# Altium project MK_175.PrjPcb
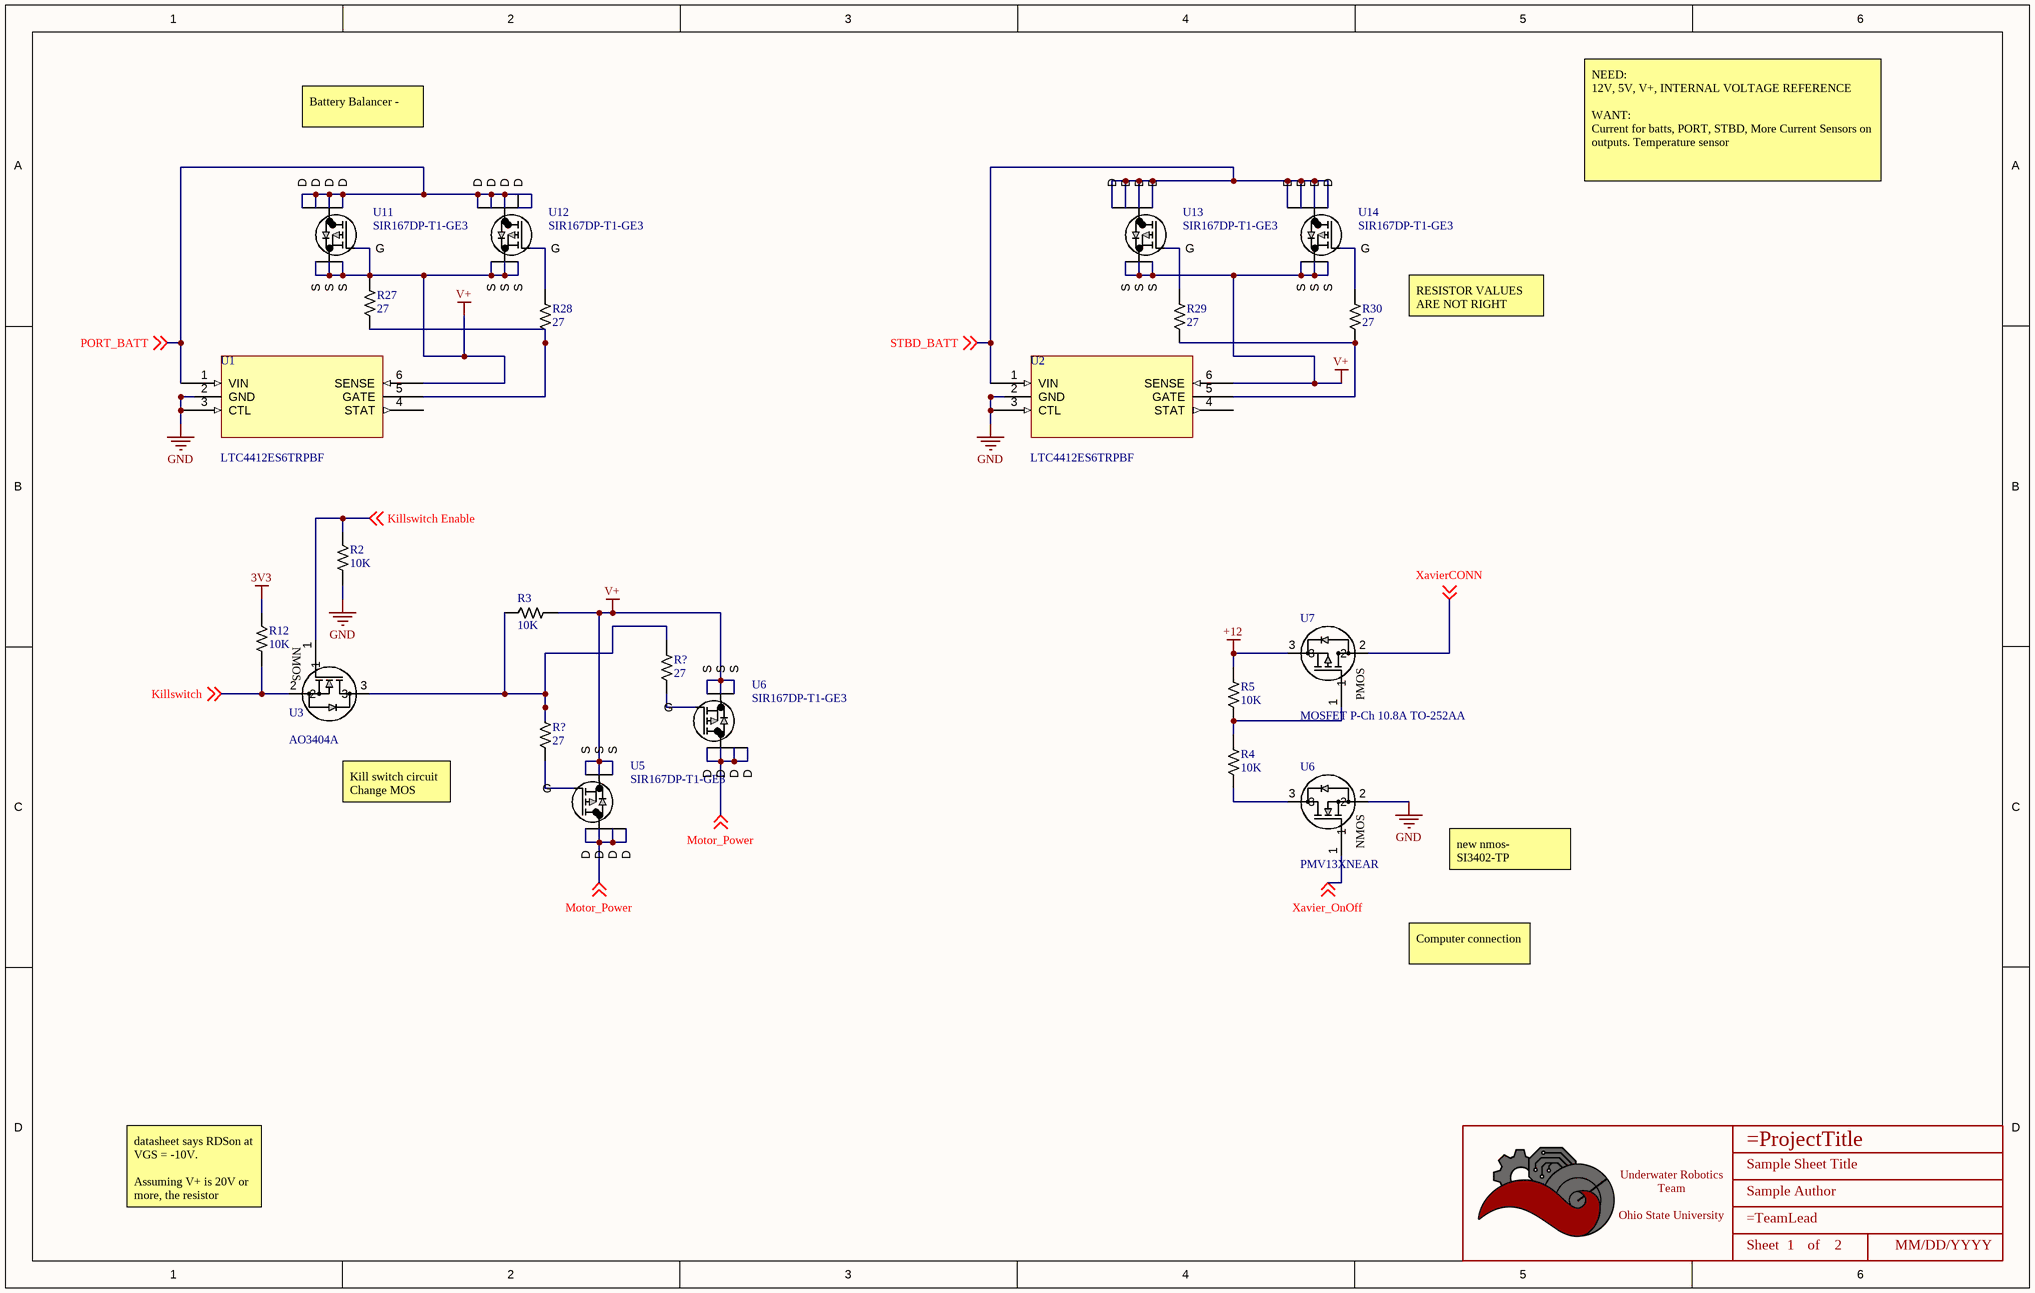
[diagram p0: M1_75S.SchDoc]
2 sheets, 44 parts. Net scope: flat (ports and power ports of the same name join across sheets).
Board file: PD1_75.PcbDoc
Sheets:
  M1_75S.SchDoc
  M1_75S2.SchDoc

## Sheet M1_75S.SchDoc: Sample Sheet Title
size B; Date: MM/DD/YYYY; Author: Sample Author; Organization: ORGANIZATION; Address1: ADDRESS 1; Address2: ADDRESS 2; Address3: ADDRESS 3; Address4: ADDRESS 4; Revision: -; SheetNumber: 1; SheetTotal: 2; ENG_APP_DATE: --/--/--; DSN_APP_DATE: --/--/--; CHK_APP_DATE: --/--/--

### Parts
(Parts that share a designator on the sheet are numbered #1, #2 ... from top to bottom, then left to right.)
*#1  Title_Block  [LOGO]  (value not drawn)  (graphical)
R2  Value  (Ohms): 10K  [RESISTOR_0603]  (hidden comment: 10k Ohm 5% 1/10W)
R3  Value  (Ohms): 10K  [RESISTOR_0603]  (hidden comment: 10k Ohm 5% 1/10W)
R4  Value  (Ohms): 10K  [RESISTOR_0603]  (hidden comment: 10k Ohm 5% 1/10W)
R5  Value  (Ohms): 10K  [RESISTOR_0603]  (hidden comment: 10k Ohm 5% 1/10W)
R12  Value  (Ohms): 10K  [RESISTOR_0603]  (hidden comment: 10k Ohm 5% 1/10W)
R27  Value  (Ohms): 27  [RESISTOR_0603]  (hidden comment: 27 Ohm 5% 1/8W)
R28  Value  (Ohms): 27  [RESISTOR_0603]  (hidden comment: 27 Ohm 5% 1/8W)
R29  Value  (Ohms): 27  [RESISTOR_0603]  (hidden comment: 27 Ohm 5% 1/8W)
R30  Value  (Ohms): 27  [RESISTOR_0603]  (hidden comment: 27 Ohm 5% 1/8W)
R?#1  Value  (Ohms): 27  [RESISTOR_0603]  (hidden comment: 27 Ohm 5% 1/8W)
R?#2  Value  (Ohms): 27  [RESISTOR_0603]  (hidden comment: 27 Ohm 5% 1/8W)
U1  LTC4412ES6TRPBF  [TSOT-23_S6]
U2  LTC4412ES6TRPBF  [TSOT-23_S6]
U3  AO3404A  [SOT-23-3]
U5  SIR167DP-T1-GE3  [MOSFET_7DP-T1-GE3_VIS]
U6#1  SIR167DP-T1-GE3  [MOSFET_7DP-T1-GE3_VIS]
U6#2  PMV13XNEAR  [SOT-23-3]
U7  MOSFET P-Ch 10.8A TO-252AA  [DPAK_ONS]
U11  SIR167DP-T1-GE3  [MOSFET_7DP-T1-GE3_VIS]
U12  SIR167DP-T1-GE3  [MOSFET_7DP-T1-GE3_VIS]
U13  SIR167DP-T1-GE3  [MOSFET_7DP-T1-GE3_VIS]
U14  SIR167DP-T1-GE3  [MOSFET_7DP-T1-GE3_VIS]

### Nets
3V3: R12.2
+12: R5.1 U7.3
GND: R2.1 U1.2(GND) U1.3(CTL) U2.2(GND) U2.3(CTL) U6#2.2
V+: R3.1 R27.1 U1.6(SENSE) U2.6(SENSE) U5.1(S) U5.2(S) U5.3(S) U6#1.1(S) U6#1.2(S) U6#1.3(S) U11.1(S) U11.2(S) U11.3(S) U11.4(G) U12.1(S) U12.2(S) U12.3(S) U13.1(S) U13.2(S) U13.3(S) U14.1(S) U14.2(S) U14.3(S)
Killswitch: R12.1 U3.2 ; off-sheet Killswitch
Killswitch Enable: R2.2 U3.1 ; off-sheet Killswitch Enable
Motor_Power: U5.5(D) U5.6(D) U5.7(D) U5.8(D) U6#1.5(D) U6#1.6(D) U6#1.7(D) U6#1.8(D) ; off-sheet Motor_Power
PORT_BATT: U1.1(VIN) U11.5(D) U11.6(D) U11.7(D) U11.8(D) U12.5(D) U12.6(D) U12.7(D) U12.8(D) ; off-sheet PORT_BATT
STBD_BATT: U2.1(VIN) U13.5(D) U13.6(D) U13.7(D) U13.8(D) U14.5(D) U14.6(D) U14.7(D) U14.8(D) ; off-sheet STBD_BATT
Xavier_OnOff: U6#2.1 ; off-sheet Xavier_OnOff
XavierCONN: U7.2 ; off-sheet XavierCONN
NetR3_2: R3.2 R?#1.1 R?#2.1 U3.3
NetR4_1: R4.1 R5.2 U7.1
NetR4_2: R4.2 U6#2.3
NetR27_2: R27.2 R28.2 U1.5(GATE)
NetR28_1: R28.1 U12.4(G)
NetR29_1: R29.1 U13.4(G)
NetR29_2: R29.2 R30.2 U2.5(GATE)
NetR30_1: R30.1 U14.4(G)
NetR?#1_2: R?#1.2 U6#1.4(G)
NetR?#2_2: R?#2.2 U5.4(G)

Not connected (* = marked no-connect by the designer): U1 4(STAT); U2 4(STAT)

### Notes on the sheet
- Battery Balancer -
- NEED:
  12V, 5V, V+, INTERNAL VOLTAGE REFERENCE
  WANT:
  Current for batts, PORT, STBD, More Current Sensors on outputs. Temperature sensor
- RESISTOR VALUES ARE NOT RIGHT (R27-R30)
- Kill switch circuit Change MOS
- new nmos- SI3402-TP https://www.digikey.com/en/products/detail/micro-commercial-co/SI3402-TP/7681854
- Computer connection
- datasheet says RDSon at VGS = -10V.
  Assuming V+ is 20V or more, the resistor divider will make Vg 10 V which would mean VGS is -10V
- DWG. NO.
- REV.
- SHT.
- THIS DOCUMENT AND THE DATA DISCLOSED HEREIN OR HEREWITH IS THE PROPERTY OF ALTIUM LIMITED AND MAY BE FREELY DISTRIBUTED IN WHOLE. NO RIGHTS ARE RESERVED OR EXPRESS OR IMPLIED WARANTEE GIVEN.
- REVISION
- DESCRIPTION
- DATE
- APPROVED
- ENG:
- APPROVALS
- PROJECT
- DSN:
- CHK:
- REFERENCE DOCUMENTS
- PROJECT REVISION:
- TITLE
- DOCUMENT REVISION:
- DESIGN ITEM:
- BOM:
- FAB DWG:
- PCB DWG:
- ASSY DWG:
- SCALE:
- SIZE
- B
- CAGE CODE
- FILE NAME
- DWG NO.
- SHEET
- OF
- REV
- (in symbol AO3404A) NMOS
- (in symbol FDD4141) PMOS
- (in symbol PMV13XNEAR) NMOS
- (in symbol Title_Block) Underwater Robotics Team / Ohio State University; Sheet; of

### Library data of the parts
*#1 = Title_Block: UWRT Schematic Title Block Template / Created June 2021, Dylan Trainor
R2-R5 R12 = RESISTOR_10K_0603: RES 10k OHM 5% 1/10W 0603; Tolerance: +/- 5%; Wattage: 1/8W; Made By: Robert Pafford; ComponentLink1Description: Datasheet; ComponentLink1URL: https://www.bourns.com/docs/product-datasheets/CRxxxxx.pdf; Supplier: Digikey; Digikey Part Numer: CR0603-JW-104ELFTR-ND; Supplier 1: Digi-Key; Supplier Part Number 1: 2019-RK73B1JTTD103JCT-ND
R27-R30 R?#1 R?#2 = RESISTOR_27_0603: RES 27 OHM 5% 1/8W 0603; Tolerance: +/- 5%; Made By: Robert Pafford; ComponentLink1Description: Datasheet; ComponentLink1URL: https://www.bourns.com/docs/product-datasheets/CRxxxxx.pdf; Wattage: 1/8W; Supplier: Digikey; Digikey Part Numer: CR0603-JW-104ELFTR-ND; Supplier 1: Digi-Key; Supplier Part Number 1: 2019-RK73B1JTTD270JCT-ND
U1 U2 = LTC4412ES6TRPBF: OR Controller Source Selector Switch P-Channel 2:1 TSOT-23-6; MP: LTC4412ES6#TRPBF; MF: Analog Devices; Price: None; Availability: Good; Mouser-Purchase-URL: https://snapeda.com/shop?store=Mouser&id=4343773; Arrow_Europe-Purchase-URL: https://snapeda.com/shop?store=Arrow+Europe&id=4343773; DigiKey-Purchase-URL: https://snapeda.com/shop?store=DigiKey&id=4343773; Package: SOT-23-6 Analog Devices; SnapEDA_Link: https://www.snapeda.com/parts/LTC4412ES6%23TRPBF/Analog%20Devices/view-part/4343773/?ref=snap; Value: *; Check_prices: https://www.snapeda.com/parts/LTC4412ES6%23TRPBF/Analog%20Devices/view-part/4343773/?ref=eda
U3 = AO3404A: N-Channel 30 V 5.8A (Ta) 1.4W (Ta) Surface Mount SOT-23-3; Vendor: Alpha & Omega Semiconductor Inc.; SourceLibrary: ON_Semiconductor_2020-01-13; Vgs (Max): 3V @ 5.8A, 10V; Vgs (th): 3V @ 250µA; Vdss: 30V; Rds (on): 28mOhm @ 5.8A, 10V; Amp Rating: 5.8 A; FET Type: N-Channel; Package: SOT23-3L; Manufacturer _Part_Number: AO3404A; Power Dissipation: 1.4W (Ta); Supplier 1: Digi-Key; Supplier Part Number 1: 785-1004-1-ND; Created By: Dylan T
U5 U6#1 U11-U14 = SIR167DP-T1-GE3: P-Channel 30 V 60A (Tc) 65.8W (Tc) Surface Mount PowerPAK® SO-8; Mfr_Name: Vishay; Copyright: Copyright (C) 2022 Ultra Librarian. All rights reserved.; Manufacturer_Part_Number: SIR167DP-T1-GE3; RefDes: RefDes; Type: DEV
U6#2 = PMV13XNEAR: N-Channel 20 V 7.3A (Ta) 610mW (Ta), 8.3W (Tc) Surface Mount TO-236AB; Vendor: Nexperia USA Inc.; SourceLibrary: ON_Semiconductor_2020-01-13; Vgs (Max): +/- 12 V; Vgs (th): 1.3V @ 250uA; Vdss: 20 V; Rds (on): 15mOhm @ 7.3A, 8V; Amp Rating: 7.3 A; FET Type: N-Channel; Package: SOT23-3L; Manufacturer _Part_Number: PMV13XNEAR; Power Dissipation: 610mW (Ta), 8.3W (Tc); Created By: Dylan T; Supplier 1: Mouser; Supplier Part Number 1: 771-PMV13XNEAR
U7 = FDD4141: P-Channel 10.8A (Ta), 50A (Tc) 2.4W (Ta), 69W (Tc) Surface Mount D-PAK (TO-252AA); FET Type: P-Channel, Power; Vendor: ON Semiconductor; SourceLibrary: ON_Semiconductor_2020-01-13; Vgs (Max): ±20V; Vgs (th): 3V @ 250µA; Vdss: 40 V; Rds (on): 12.3mOhm @ 12.7A, 10V; Amp Rating: 10.8 A; Package: D-PAK (TO-252AA); Manufacturer_Part_Number: FDD4141; Power Dissipation: 2.4W (Ta), 69W (Tc); Supplier 1: Digi-Key; Supplier Part Number 1: FDD4141CT-ND; Created By: Dylan T

## Sheet M1_75S2.SchDoc: Sample Sheet Title
size B; Date: MM/DD/YYYY; Author: Sample Author; Organization: ORGANIZATION; Address1: ADDRESS 1; Address2: ADDRESS 2; Address3: ADDRESS 3; Address4: ADDRESS 4; Revision: -; SheetNumber: 2; SheetTotal: 2; ENG_APP_DATE: --/--/--; DSN_APP_DATE: --/--/--; CHK_APP_DATE: --/--/--
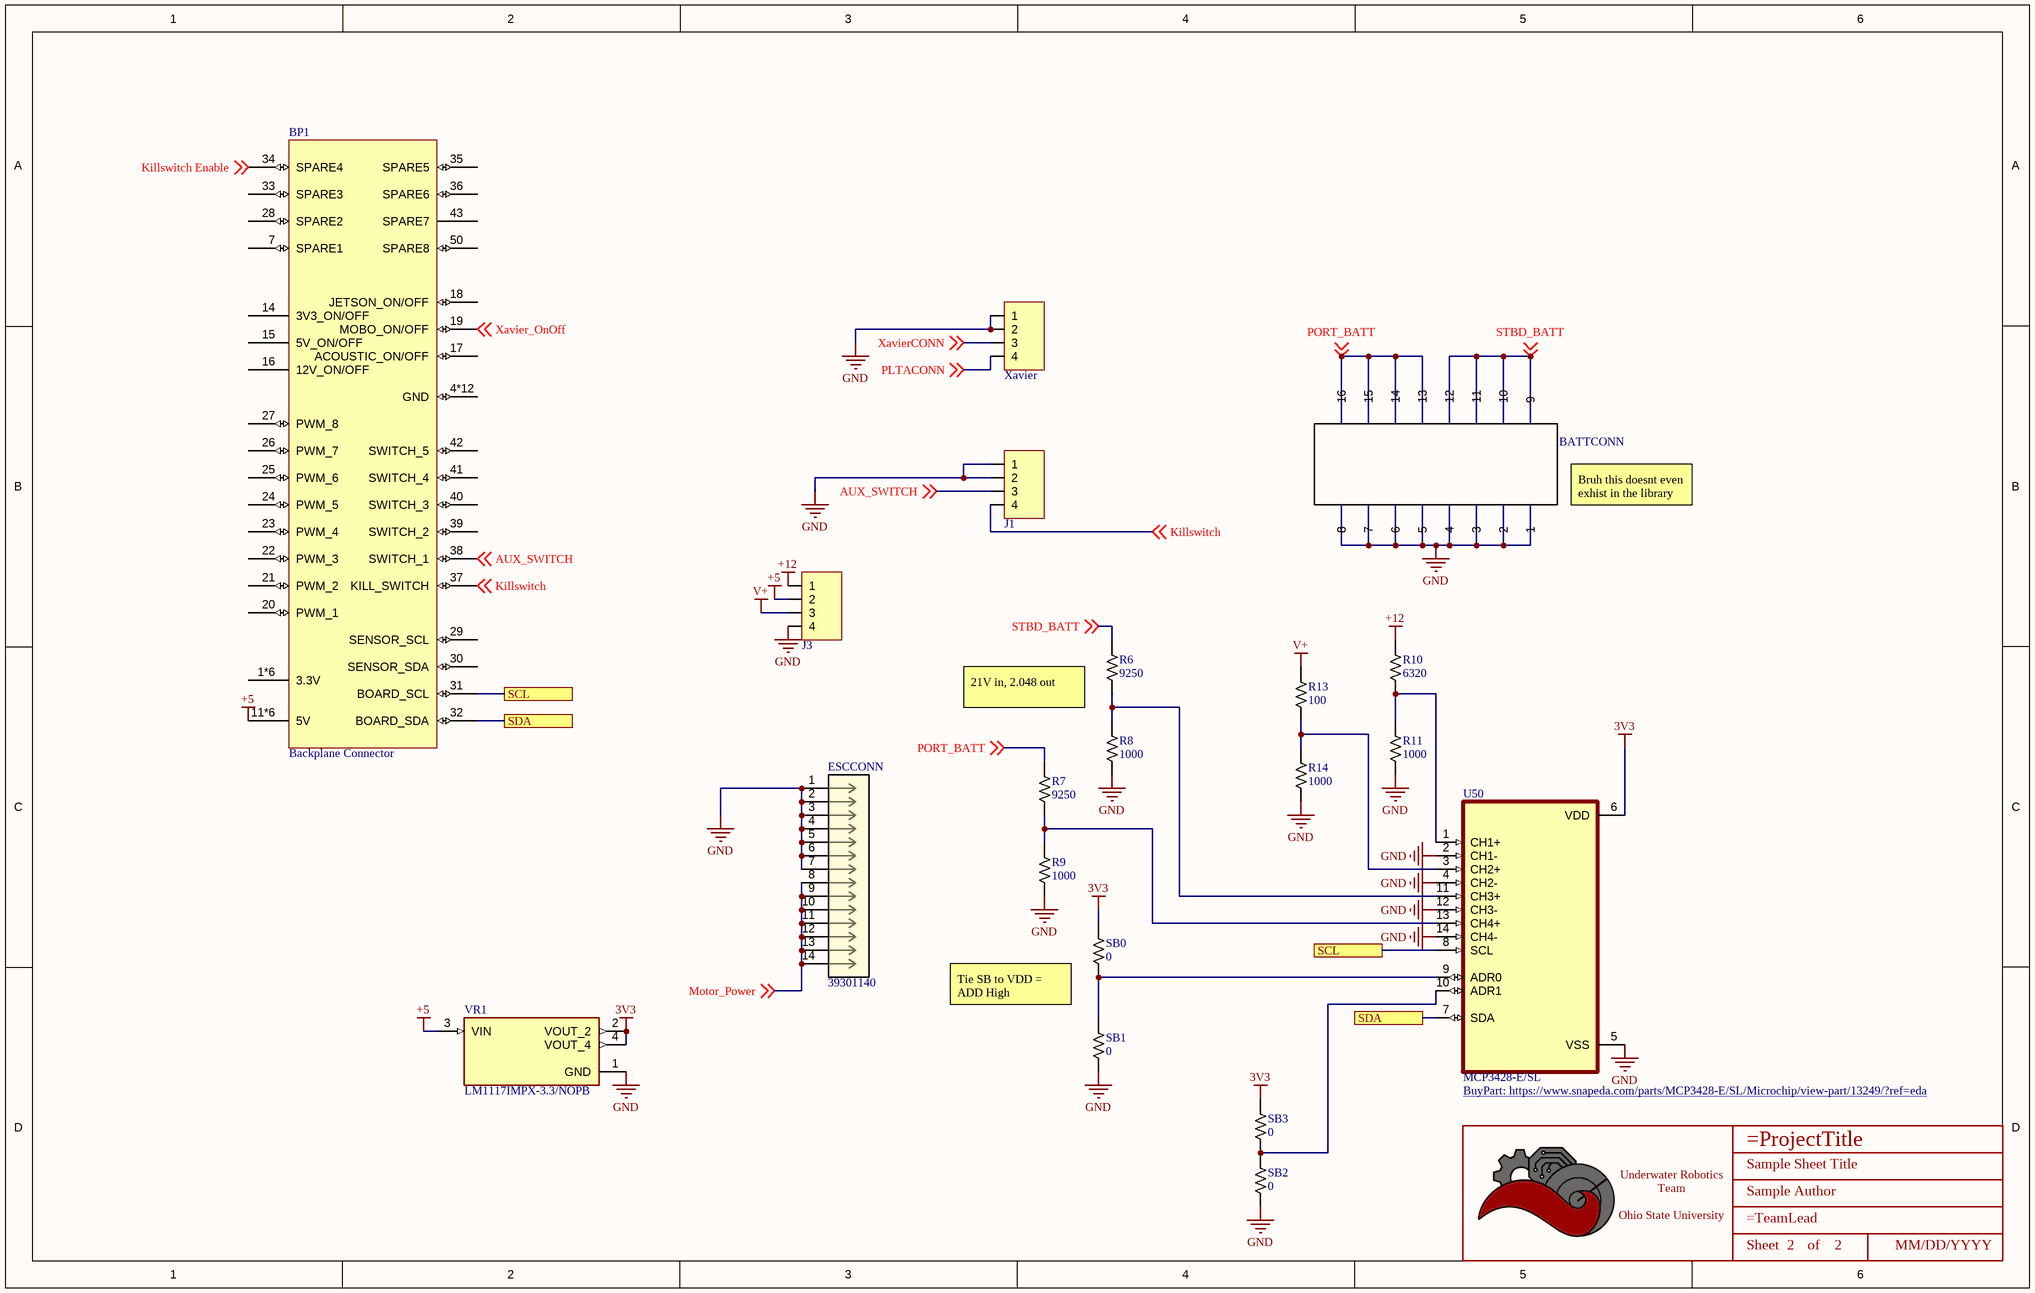
[diagram p1: M1_75S2.SchDoc]

### Parts
(Parts that share a designator on the sheet are numbered #1, #2 ... from top to bottom, then left to right.)
*#2  Title_Block  [LOGO]  (value not drawn)  (graphical)
BATTCONN  BatteryConnector  [CONN_MOLEX_MINIFIT JR_16 POS_R/A - duplicate]  (value not drawn)
BP1  Backplane Connector  [BACKPLANE_EDGE_CONN]
ESCCONN  39301140  [CON_39301140]
J1  4 POS R/A  [CONN_MOLEX_MINIFIT JR_4 POS_R/A]  (value not drawn)
J3  4 POS R/A  [CONN_MOLEX_MINIFIT JR_4 POS_R/A]  (value not drawn)
R6  Value  (Ohms): 9250  [RESISTOR_0603]  (hidden comment: 100 Ohm 5% 1/8W)
R7  Value  (Ohms): 9250  [RESISTOR_0603]  (hidden comment: 100 Ohm 5% 1/8W)
R8  Value  (Ohms): 1000  [RESISTOR_0603]  (hidden comment: 100 Ohm 5% 1/8W)
R9  Value  (Ohms): 1000  [RESISTOR_0603]  (hidden comment: 100 Ohm 5% 1/8W)
R10  Value  (Ohms): 6320  [RESISTOR_0603]  (hidden comment: 100 Ohm 5% 1/8W)
R11  Value  (Ohms): 1000  [RESISTOR_0603]  (hidden comment: 100 Ohm 5% 1/8W)
R13  Value  (Ohms): 100  [RESISTOR_0603]  (hidden comment: 100 Ohm 5% 1/8W)
R14  Value  (Ohms): 1000  [RESISTOR_0603]  (hidden comment: 100 Ohm 5% 1/8W)
SB0  Value  (Ohms): 0  [RESISTOR_0603]  (hidden comment: 0 Ohm Jumper No Fit)
SB1  Value  (Ohms): 0  [RESISTOR_0603]  (hidden comment: 0 Ohm Jumper No Fit)
SB2  Value  (Ohms): 0  [RESISTOR_0603]  (hidden comment: 0 Ohm Jumper No Fit)
SB3  Value  (Ohms): 0  [RESISTOR_0603]  (hidden comment: 0 Ohm Jumper No Fit)
U50  MCP3428-E/SL  [SOIC127P600X175-14N]
VR1  LM1117IMPX-3.3/NOPB  [SOT-223-4]
Xavier  4 POS R/A  [CONN_MOLEX_MINIFIT JR_4 POS_R/A]  (value not drawn)

### Ports
SCL, SDA

### Nets
3V3: SB0.1 SB3.1 U50.6(VDD) VR1.2(VOUT_2) VR1.4(VOUT_4)
+5: BP1.11*6(5V) J3.2 VR1.3(VIN)
+12: J3.1 R10.1
GND: BATTCONN.1 BATTCONN.2 BATTCONN.3 BATTCONN.4 BATTCONN.5 BATTCONN.6 BATTCONN.7 BATTCONN.8 ESCCONN.1 ESCCONN.2 ESCCONN.3 ESCCONN.4 ESCCONN.5 ESCCONN.6 ESCCONN.7 J1.1 J1.2 J3.4 R8.2 R9.2 R11.2 R14.2 SB1.2 SB2.2 U50.2(CH1-) U50.4(CH2-) U50.5(VSS) U50.12(CH3-) U50.14(CH4-) VR1.1(GND) Xavier.1 Xavier.2
V+: J3.3 R13.1
AUX_SWITCH: BP1.38(SWITCH_1) J1.3 ; off-sheet AUX_SWITCH
Killswitch: BP1.37(KILL_SWITCH) J1.4 ; off-sheet Killswitch
Killswitch Enable: BP1.34(SPARE4) ; off-sheet Killswitch Enable
Motor_Power: ESCCONN.8 ESCCONN.9 ESCCONN.10 ESCCONN.11 ESCCONN.12 ESCCONN.13 ESCCONN.14 ; off-sheet Motor_Power
PLTACONN: Xavier.4 ; off-sheet PLTACONN
PORT_BATT: BATTCONN.13 BATTCONN.14 BATTCONN.15 BATTCONN.16 R7.1 ; off-sheet PORT_BATT
STBD_BATT: BATTCONN.9 BATTCONN.10 BATTCONN.11 BATTCONN.12 R6.1 ; off-sheet STBD_BATT
Xavier_OnOff: BP1.19(MOBO_ON/OFF) ; off-sheet Xavier_OnOff
XavierCONN: Xavier.3 ; off-sheet XavierCONN
NetBP1_31: BP1.31(BOARD_SCL) U50.8(SCL) ; port SCL
NetBP1_32: BP1.32(BOARD_SDA) U50.7(SDA) ; port SDA
NetR6_2: R6.2 R8.1 U50.11(CH3+)
NetR7_2: R7.2 R9.1 U50.13(CH4+)
NetR10_2: R10.2 R11.1 U50.1(CH1+)
NetR13_2: R13.2 R14.1 U50.3(CH2+)
NetSB0_2: SB0.2 SB1.1 U50.9(ADR0)
NetSB2_1: SB2.1 SB3.2 U50.10(ADR1)

Not connected (* = marked no-connect by the designer): BP1 1*6(3.3V) 4*12(GND) 7(SPARE1) 14(3V3_ON/OFF) 15(5V_ON/OFF) 16(12V_ON/OFF) 17(ACOUSTIC_ON/OFF) 18(JETSON_ON/OFF) 20(PWM_1) 21(PWM_2) 22(PWM_3) 23(PWM_4) 24(PWM_5) 25(PWM_6) 26(PWM_7) 27(PWM_8) 28(SPARE2) 29(SENSOR_SCL) 30(SENSOR_SDA) 33(SPARE3) 35(SPARE5) 36(SPARE6) 39(SWITCH_2) 40(SWITCH_3) 41(SWITCH_4) 42(SWITCH_5) 43(SPARE7) 50(SPARE8)

### Notes on the sheet
- (near BATTCONN) Bruh this doesnt even exhist in the library
- 21V in, 2.048 out
- Tie SB to VDD = ADD High
- DWG. NO.
- REV.
- SHT.
- THIS DOCUMENT AND THE DATA DISCLOSED HEREIN OR HEREWITH IS THE PROPERTY OF ALTIUM LIMITED AND MAY BE FREELY DISTRIBUTED IN WHOLE. NO RIGHTS ARE RESERVED OR EXPRESS OR IMPLIED WARANTEE GIVEN.
- REVISION
- DESCRIPTION
- DATE
- APPROVED
- ENG:
- APPROVALS
- PROJECT
- DSN:
- CHK:
- REFERENCE DOCUMENTS
- PROJECT REVISION:
- TITLE
- DOCUMENT REVISION:
- DESIGN ITEM:
- BOM:
- FAB DWG:
- PCB DWG:
- ASSY DWG:
- SCALE:
- SIZE
- B
- CAGE CODE
- FILE NAME
- DWG NO.
- SHEET
- OF
- REV
- (in symbol Title_Block) Underwater Robotics Team / Ohio State University; Sheet; of

### Library data of the parts
*#2 = Title_Block: as *#1 on sheet M1_75S
BP1 = BACKPLANE_EDGE_CONN: Titan Backplane Edge Connector; pin to pad: 1*6>1+2+3+54+55+56 4*12>4+5+6+8+9+10+47+48+49+51+52+53 11*6>11+12+13+44+45+46
ESCCONN = 39301140: No Description Available; Mfr_Name: Molex Connector Corporation; Copyright: Copyright (C) 2022 Ultra Librarian. All rights reserved.; Manufacturer_Part_Number: 39301140; RefDes: RefDes; Type: DEV
J1 J3 Xavier = CONN_MOLEX_MINIFIT JR_4POS_R/A: Molex Minifit Jr. 5569 / 4 Pos R/A Natural; Pitch: 4.2mm; Configuration: Right Angle; Current Per Pin: 13A; Number of Positions: 4; Supplier Part Number 1: WM13112-ND; Supplier 1: Digi-Key; Manufacturer: Molex; Color: Natural; Created By: Flip B; ComponentLink1Description: Datasheet; ComponentLink1URL: https://www.molex.com/pdm_docs/sd/026013115_sd.pdf; Series: Minifit Jr 5569
R6-R11 R13 R14 = RESISTOR_100_0603: RES 100 OHM 5% 1/8W 0603; Tolerance: +/- 5%; Made By: Flip B; ComponentLink1Description: Digikey; ComponentLink1URL: https://www.digikey.com/en/products/detail/koa-speer-electronics-inc/RK73B1JTTD101J/9844701; Supplier 1: Digi-Key; Supplier Part Number 1: 2019-RK73B1JTTD101JCT-ND; Wattage: 1/8W
SB0-SB3 = JUMPER_0_0603: 0 Ohm Jumper No Fit for Solder Bridge; Made By: Robert Pafford; ComponentLink1Description: Digikey; ComponentLink1URL: https://www.digikey.com/en/products/detail/koa-speer-electronics-inc/RK73B1JTTD101J/9844701
U50 = MCP3428-E/SL: 16 Bit Analog to Digital Converter 4 Input 1 Sigma-Delta 14-SOIC; MF: Microchip; Package: SOIC-14 Microchip; SnapEDA_Link: https://www.snapeda.com/parts/MCP3428-E/SL/Microchip/view-part/13249/?ref=snap; MP: MCP3428-E/SL; Price: None; Availability: Unavailable; Value: *; BuyPart: https://www.snapeda.com/parts/MCP3428-E/SL/Microchip/view-part/13249/?ref=eda
VR1 = LM1117IMPX-3.3/NOPB: 800-mA 15-V linear voltage regulator 4-SOT-223 -40 to 125; MF: Texas Instruments; Texas_Instruments-Purchase-URL: https://snapeda.com/shop?store=Texas+Instruments&id=410186; Price: None; Mouser-Purchase-URL: https://snapeda.com/shop?store=Mouser&id=410186; MP: LM1117IMPX-3.3/NOPB; Value: *; Availability: Good; Package: SOT-223-4 Texas Instruments; Arrow_Electronics-Purchase-URL: https://snapeda.com/shop?store=Arrow+Electronics&id=410186; SnapEDA_Link: https://www.snapeda.com/parts/LM1117IMPX-3.3/NOPB/Texas%20Instruments/view-part/410186/?ref=snap; DigiKey-Purchase-URL: https://snapeda.com/shop?store=DigiKey&id=410186

## Nets that join several sheets
3V3: M1_75S (R12.2), M1_75S2 (5 pins)
+12: M1_75S (R5.1 U7.3), M1_75S2 (J3.1 R10.1)
GND: M1_75S (6 pins), M1_75S2 (32 pins)
V+: M1_75S (23 pins), M1_75S2 (J3.3 R13.1)
Killswitch: M1_75S (R12.1 U3.2), M1_75S2 (BP1.37 J1.4)
Killswitch Enable: M1_75S (R2.2 U3.1), M1_75S2 (BP1.34)
Motor_Power: M1_75S (8 pins), M1_75S2 (7 pins)
PORT_BATT: M1_75S (9 pins), M1_75S2 (5 pins)
STBD_BATT: M1_75S (9 pins), M1_75S2 (5 pins)
Xavier_OnOff: M1_75S (U6#2.1), M1_75S2 (BP1.19)
XavierCONN: M1_75S (U7.2), M1_75S2 (Xavier.3)